# Altium schematic sheet GRIx4.SchDoc
size 420 x 297 mm; 1_Listov: 1; 1_Naimenovanie1: Часы цифровые; 1_Naimenovanie2: электровакуумные GRIx4; 1_Naimenovanie3: Схема электрическая принципиальная; 1_Oboznachenie: КДМТ.403271.001 Э3; 1_T1Razrabotal: Карманов Д.; 1_T2Proveril: Муханов Т.; PageSetup: Record=PageOptions|CenterHorizontal=True|CenterVertical=True|PrintScale=0.98|XCorrection=1.00|YCorrection=1.00|PrintKind=1|BorderSize=5000000|LeftOffset=0|BottomOffset=0|Orientation=2|PaperLength=1000|PaperWidth=1000|Scale=100|PaperSource=7|PrintQuality=-3|MediaType=1|DitherType=10|PrintScaleMode=1|PaperKind=A3|PaperIndex=8
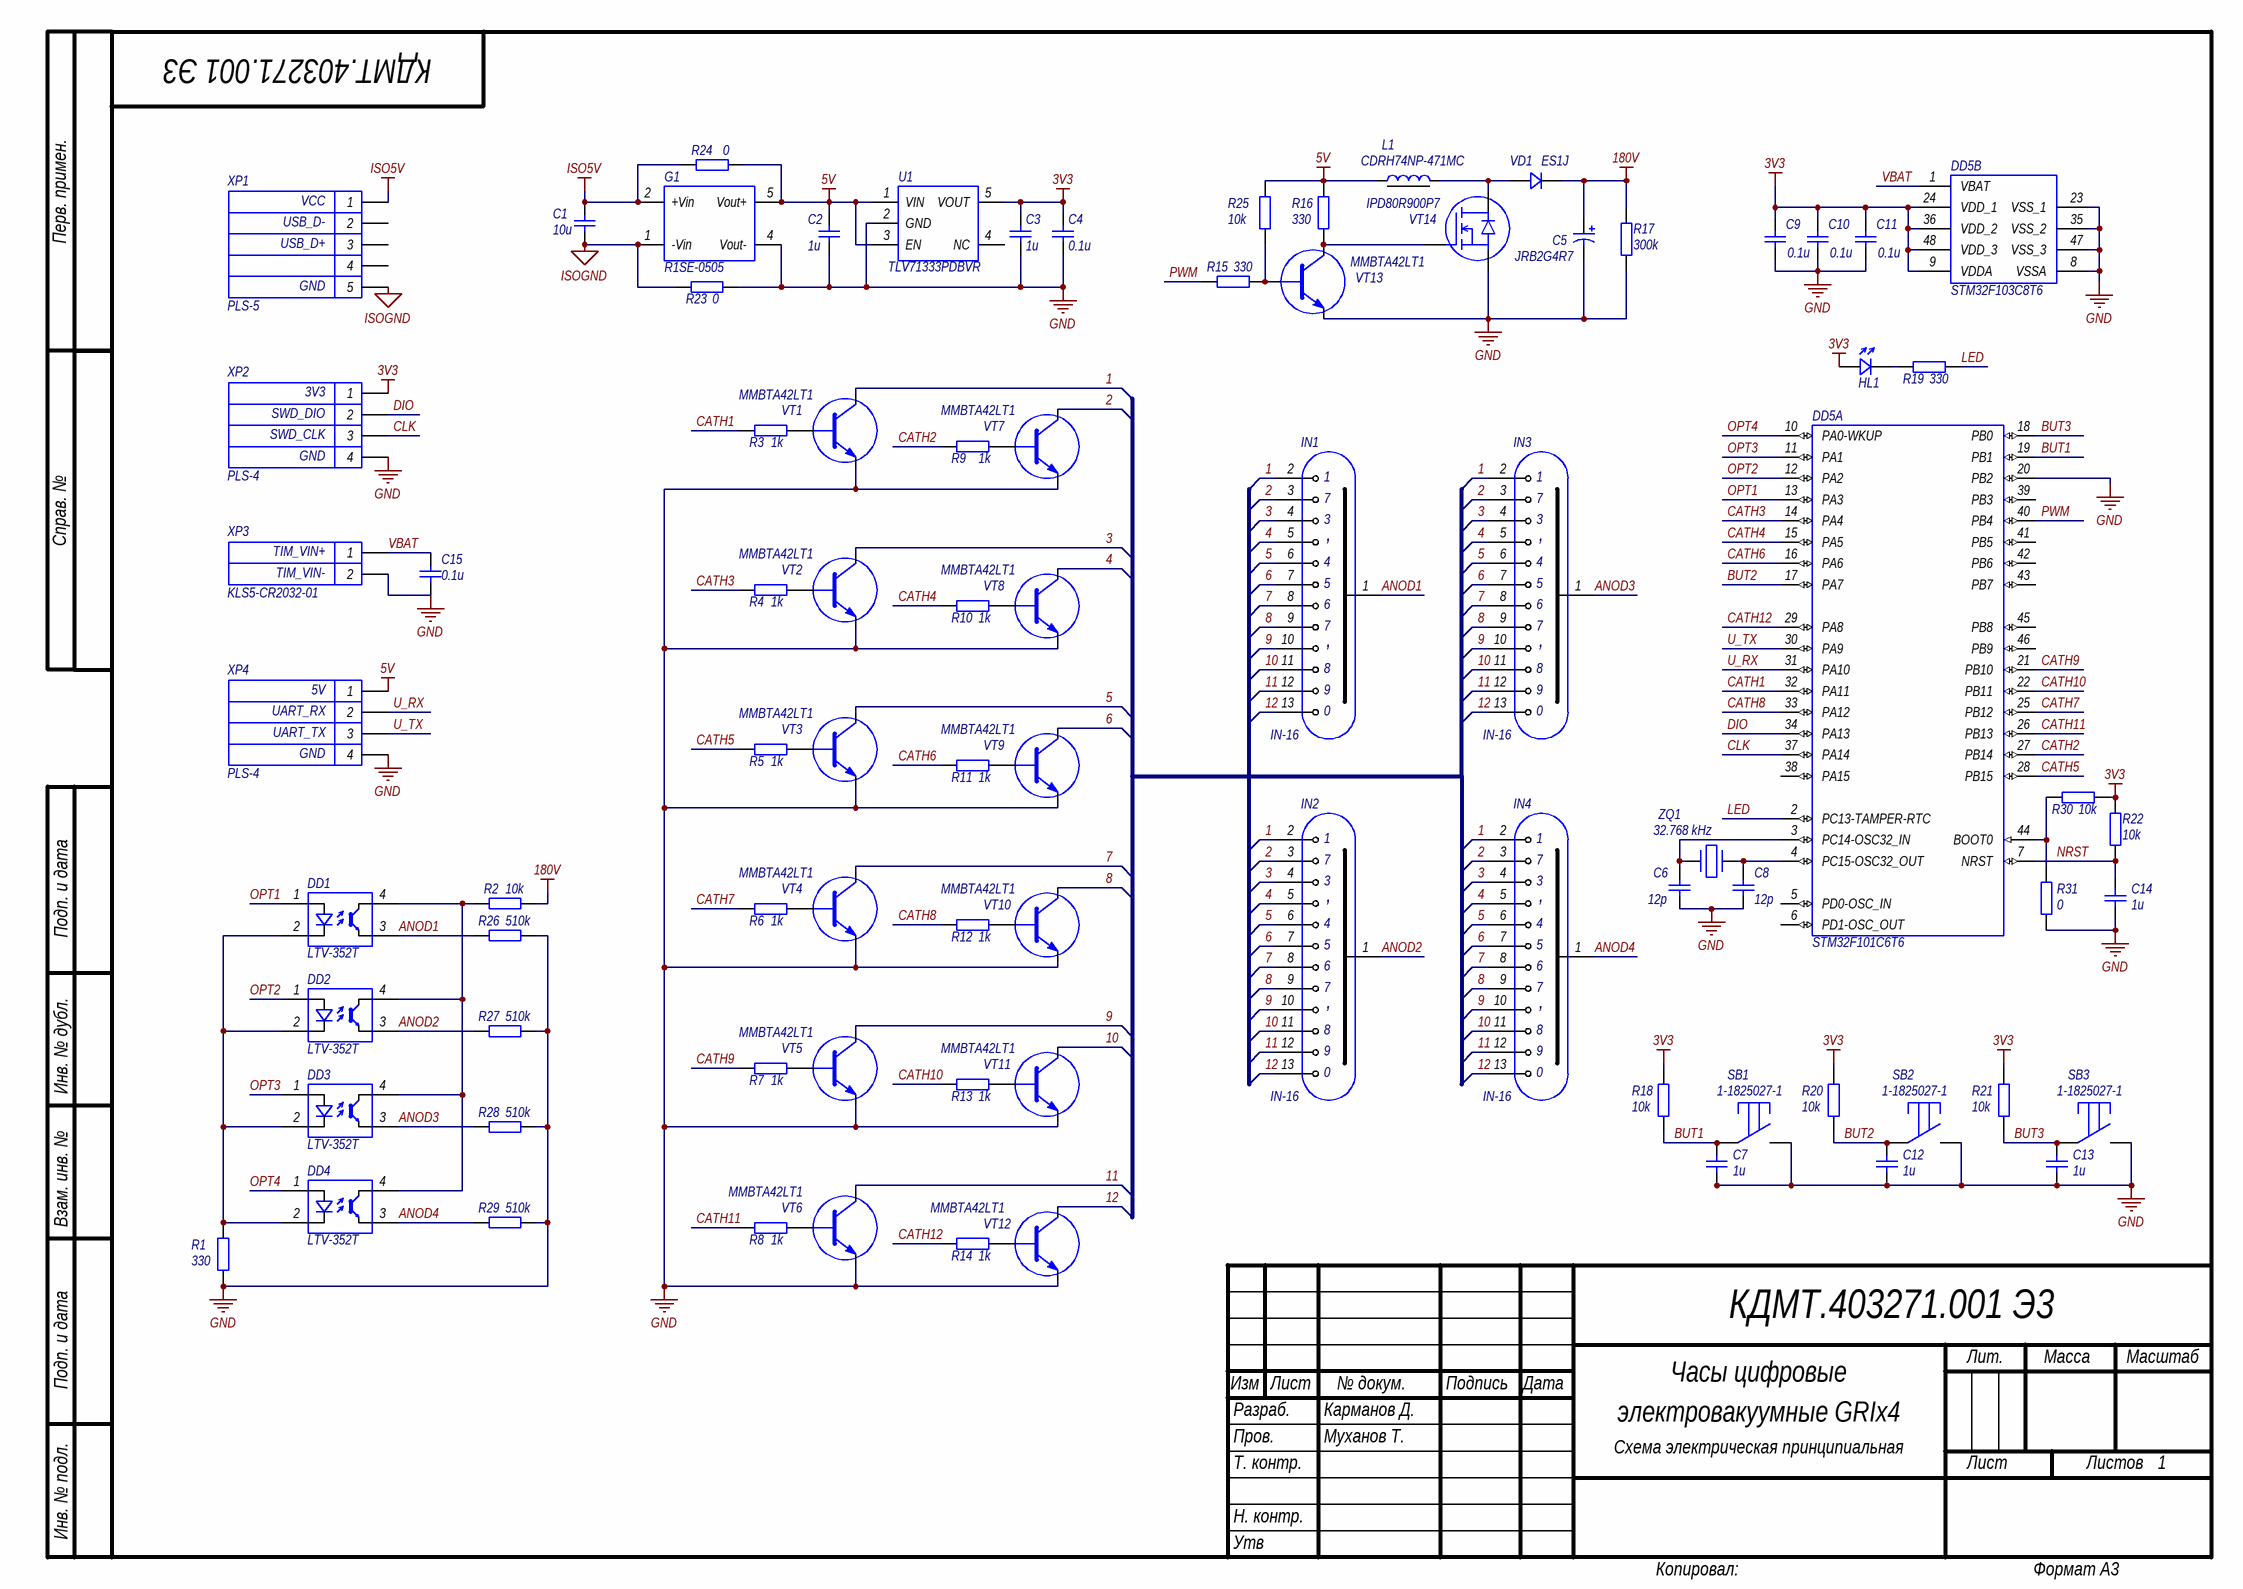
[diagram p0: GRIx4.SchDoc]

## Parts
C1  10u  [CAPACITOR 0805]
C2  1u  [CAPACITOR 0603]
C3  1u  [CAPACITOR 0603]
C4  0.1u  [CAPACITOR 0603]
C5  JRB2G4R7  [CAPASITOR R10]
C6  12p  [CAPACITOR 0603]
C7  1u  [CAPACITOR 0603]
C8  12p  [CAPACITOR 0603]
C9  0.1u  [CAPACITOR 0603]
C10  0.1u  [CAPACITOR 0603]
C11  0.1u  [CAPACITOR 0603]
C12  1u  [CAPACITOR 0603]
C13  1u  [CAPACITOR 0603]
C14  1u  [CAPACITOR 0603]
C15  0.1u  [CAPACITOR 0603]
DD1  LTV-352T  [SOP-4W]
DD2  LTV-352T  [SOP-4W]
DD3  LTV-352T  [SOP-4W]
DD4  LTV-352T  [SOP-4W]
DD5  STM32F101C6T6  [LQFP-48]  (parts A,B of 2)
G1  R1SE-0505  [R1SE-0505]
HL1  LED  [LED 0603]  (value not drawn)
IN1  IN-16  [IN-16]
IN2  IN-16  [IN-16]
IN3  IN-16  [IN-16]
IN4  IN-16  [IN-16]
L1  CDRH74NP-471MC  [SRR0603B]
R1  330  [RESISTOR 0603]
R2  10k  [RESISTOR 0603]
R3  1k  [RESISTOR 0603]
R4  1k  [RESISTOR 0603]
R5  1k  [RESISTOR 0603]
R6  1k  [RESISTOR 0603]
R7  1k  [RESISTOR 0603]
R8  1k  [RESISTOR 0603]
R9  1k  [RESISTOR 0603]
R10  1k  [RESISTOR 0603]
R11  1k  [RESISTOR 0603]
R12  1k  [RESISTOR 0603]
R13  1k  [RESISTOR 0603]
R14  1k  [RESISTOR 0603]
R15  330  [RESISTOR 0603]
R16  330  [RESISTOR 0603]
R17  300k  [RESISTOR 0805]
R18  10k  [RESISTOR 0603]
R19  330  [RESISTOR 0603]
R20  10k  [RESISTOR 0603]
R21  10k  [RESISTOR 0603]
R22  10k  [RESISTOR 0603]
R23  0  [RESISTOR 1206]
R24  0  [RESISTOR 1206]
R25  10k  [RESISTOR 0603]
R26  510k  [RESISTOR 0603]
R27  510k  [RESISTOR 0603]
R28  510k  [RESISTOR 0603]
R29  510k  [RESISTOR 0603]
R30  10k  [RESISTOR 0603]
R31  0  [JAMP 0603]
SB1  1-1825027-1  [BUTTON-R]
SB2  1-1825027-1  [BUTTON-R]
SB3  1-1825027-1  [BUTTON-R]
U1  TLV71333PDBVR  [SOT23-5]
VD1  ES1J  [DO-214]
VT1  MMBTA42LT1  [SOT-23]
VT2  MMBTA42LT1  [SOT-23]
VT3  MMBTA42LT1  [SOT-23]
VT4  MMBTA42LT1  [SOT-23]
VT5  MMBTA42LT1  [SOT-23]
VT6  MMBTA42LT1  [SOT-23]
VT7  MMBTA42LT1  [SOT-23]
VT8  MMBTA42LT1  [SOT-23]
VT9  MMBTA42LT1  [SOT-23]
VT10  MMBTA42LT1  [SOT-23]
VT11  MMBTA42LT1  [SOT-23]
VT12  MMBTA42LT1  [SOT-23]
VT13  MMBTA42LT1  [SOT-23]
VT14  IPD80R900P7  [DPAK]
XP1  PLS-5  [USB-mini]
XP2  PLS-4  [PLS-4]
XP3  KLS5-CR2032-01  [CR2032]
XP4  PLS-4  [PLS-4]
ZQ1  32.768 kHz  [SMD08038C4]

## Nets
3V3: C3.2 C4.2 C9.2 C10.2 C11.2 DD5.9(VDDA) DD5.24(VDD_1) DD5.36(VDD_2) DD5.48(VDD_3) HL1.2(A) R18.2 R20.2 R21.2 R22.2 R30.1 U1.5(VOUT) XP2.1
5V: C2.2 G1.5(Vout+) L1.1 R16.1 R24.2 R25.1 U1.1(VIN) U1.3(EN) XP4.1
180V: C5.1 R2.2 R17.2 VD1.1(K)
GND: C2.1 C3.1 C4.1 C5.2 C6.1 C7.2 C8.1 C9.1 C10.1 C11.1 C12.2 C13.2 C14.1 C15.2 DD5.8(VSSA) DD5.20(PB2) DD5.23(VSS_1) DD5.35(VSS_2) DD5.47(VSS_3) G1.4(Vout-) R1.1 R17.1 R23.2 R26.1 R27.1 R28.1 R29.1 R31.1 SB1.2 SB2.2 SB3.2 U1.2(GND) VT1.2(E) VT2.2(E) VT3.2(E) VT4.2(E) VT5.2(E) VT6.2(E) VT7.2(E) VT8.2(E) VT9.2(E) VT10.2(E) VT11.2(E) VT12.2(E) VT13.2(E) VT14.2(S) XP2.4 XP3.2 XP4.4
ISO5V: C1.1 G1.2(+Vin) R24.1 XP1.1
ISOGND: C1.2 G1.1(-Vin) R23.1 XP1.5
1: IN1.2 IN2.2 IN3.2 IN4.2 VT1.3(C)
2: IN1.3 IN2.3 IN3.3 IN4.3 VT7.3(C)
3: IN1.4 IN2.4 IN3.4 IN4.4 VT2.3(C)
4: IN1.5 IN2.5 IN3.5 IN4.5 VT8.3(C)
5: IN1.6 IN2.6 IN3.6 IN4.6 VT3.3(C)
6: IN1.7 IN2.7 IN3.7 IN4.7 VT9.3(C)
7: IN1.8 IN2.8 IN3.8 IN4.8 VT4.3(C)
8: IN1.9 IN2.9 IN3.9 IN4.9 VT10.3(C)
9: IN1.10 IN2.10 IN3.10 IN4.10 VT5.3(C)
10: IN1.11 IN2.11 IN3.11 IN4.11 VT11.3(C)
11: IN1.12 IN2.12 IN3.12 IN4.12 VT6.3(C)
12: IN1.13 IN2.13 IN3.13 IN4.13 VT12.3(C)
ANOD1: DD1.3(PD1C) IN1.1(LED-) R26.2
ANOD2: DD2.3(PD1C) IN2.1(LED-) R27.2
ANOD3: DD3.3(PD1C) IN3.1(LED-) R28.2
ANOD4: DD4.3(PD1C) IN4.1(LED-) R29.2
BUT1: C7.1 DD5.19(PB1) R18.1 SB1.1
BUT2: C12.1 DD5.17(PA7) R20.1 SB2.1
BUT3: C13.1 DD5.18(PB0) R21.1 SB3.1
CATH1: DD5.32(PA11) R3.1
CATH2: DD5.27(PB14) R9.1
CATH3: DD5.14(PA4) R4.1
CATH4: DD5.15(PA5) R10.1
CATH5: DD5.28(PB15) R5.1
CATH6: DD5.16(PA6) R11.1
CATH7: DD5.25(PB12) R6.1
CATH8: DD5.33(PA12) R12.1
CATH9: DD5.21(PB10) R7.1
CATH10: DD5.22(PB11) R13.1
CATH11: DD5.26(PB13) R8.1
CATH12: DD5.29(PA8) R14.1
CLK: DD5.37(PA14) XP2.3
DIO: DD5.34(PA13) XP2.2
LED: DD5.2(PC13-TAMPER-RTC) R19.1
NRST: C14.2 DD5.7(NRST) R22.1
OPT1: DD1.1(LED-) DD5.13(PA3)
OPT2: DD2.1(LED-) DD5.12(PA2)
OPT3: DD3.1(LED-) DD5.11(PA1)
OPT4: DD4.1(LED-) DD5.10(PA0-WKUP)
PWM: DD5.40(PB4) R15.2
U_RX: DD5.31(PA10) XP4.2
U_TX: DD5.30(PA9) XP4.3
VBAT: C15.1 DD5.1(VBAT) XP3.1
NetC6_2: C6.2 DD5.3(PC14-OSC32_IN) ZQ1.1
NetC8_2: C8.2 DD5.4(PC15-OSC32_OUT) ZQ1.4
NetDD1_2: DD1.2(LED+) DD2.2(LED+) DD3.2(LED+) DD4.2(LED+) R1.2
NetDD1_4: DD1.4(PD1A) DD2.4(PD1A) DD3.4(PD1A) DD4.4(PD1A) R2.1
NetDD5_44: DD5.44(BOOT0) R30.2 R31.2
NetHL1_1: HL1.1(K) R19.2
NetL1_2: L1.2 VD1.2(A) VT14.3(D)
NetR3_2: R3.2 VT1.1(B)
NetR4_2: R4.2 VT2.1(B)
NetR5_2: R5.2 VT3.1(B)
NetR6_2: R6.2 VT4.1(B)
NetR7_2: R7.2 VT5.1(B)
NetR8_2: R8.2 VT6.1(B)
NetR9_2: R9.2 VT7.1(B)
NetR10_2: R10.2 VT8.1(B)
NetR11_2: R11.2 VT9.1(B)
NetR12_2: R12.2 VT10.1(B)
NetR13_2: R13.2 VT11.1(B)
NetR14_2: R14.2 VT12.1(B)
NetR15_1: R15.1 R25.2 VT13.1(B)
NetR16_2: R16.2 VT13.3(C) VT14.1(G)

Not connected (* = marked no-connect by the designer): DD5 5(PD0-OSC_IN) 6(PD1-OSC_OUT) 38(PA15) 39(PB3) 41(PB5) 42(PB6) 43(PB7) 45(PB8) 46(PB9); U1 4(NC); XP1 2 3 4

## Notes on the sheet
- (near XP1) USB_D+
- (near XP1) USB_D-
- (near XP1) VCC
- (near XP1) GND
- (near XP2) 3V3
- (near XP2) GND
- (near XP2) SWD_CLK
- (near XP2) SWD_DIO
- (near XP3) TIM_VIN+
- (near XP3) TIM_VIN-
- (near XP4) UART_RX
- (near XP4) 5V
- (near XP4) GND
- (near XP4) UART_TX
- Перв. примен.
- Справ. №
- Подп. и дата
- Инв. № дубл.
- Взам. инв. №
- Изм
- Лист
- № докум.
- Подпись
- Дата
- Лит.
- Масса
- Масштаб
- Разраб.
- Пров.
- Т. контр.
- Листов
- Инв. № подл.
- Н. контр.
- Утв
- Копировал:
- Формат А3
- (in symbol IN-16) ,; 0

## Library data of the parts
C1-C4 C6-C15 = SMD-CAP: Capacitor
C5 = TC-D: Value: {Value}
DD1-DD4 = ACPL-217-500E: Isolator
DD5 = STM32F103C8T6: Controller
G1 = R1SE-0505: POWER
IN1-IN4 = IN-16: Isolator
L1 = Inductor
R1-R31 = SMD-RES: Resistor
SB1-SB3 = SWITCH: Button
U1 = TPS76333DBVR: POWER
VD1 = D-Diod: Diod
VT1-VT13 = Transistor-NPN: Transistor; Обозначение для заказа: IRLML2502TRPBF
VT14 = Channel-N: Transistor; Обозначение для заказа: IRLML2502TRPBF
XP1 = XP5: Connector
XP2 XP4 = XP4: Connector
XP3 = XP2: Connector
ZQ1 = Quartz-ALARM: Quartz